# Altium schematic sheet [06] IN_OUT_SENSOR.SchDoc
size A4
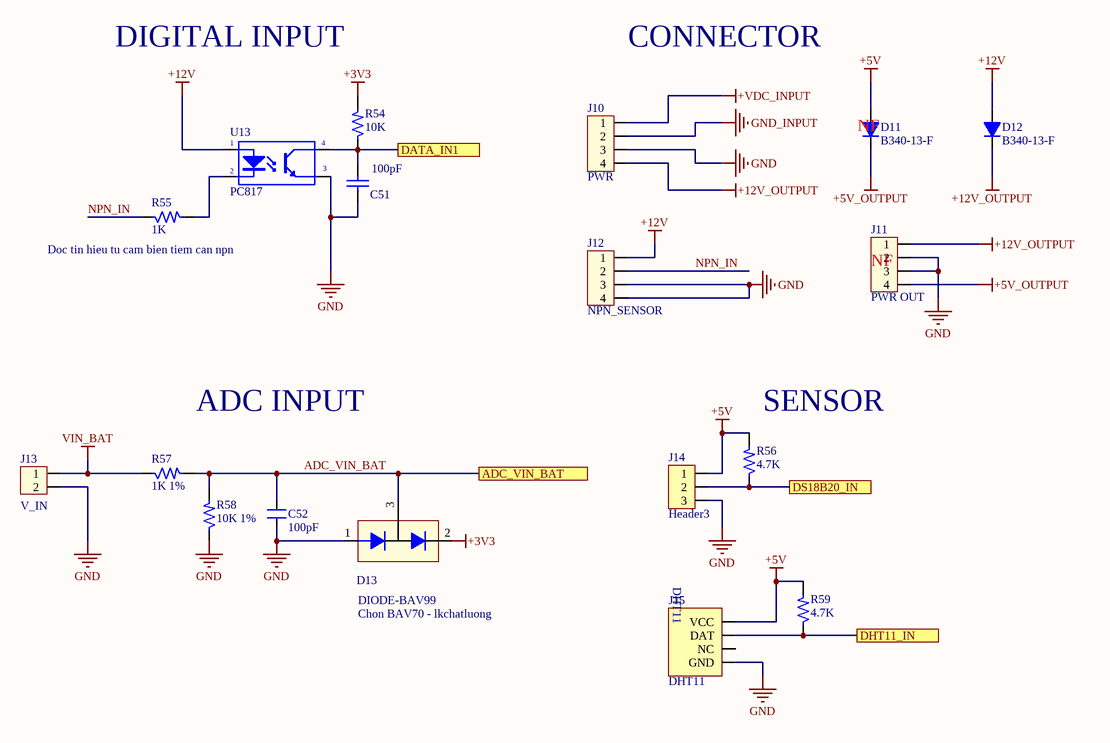
[diagram p0: [06] IN_OUT_SENSOR.SchDoc]

## Parts
C51  100pF  [CAP_0805]
C52  100pF  [CAP_0805]
D11  B340-13-F  [DO-214AB SMA]
D12  B340-13-F  [DO-214AB SMA]
D13  DIODE-BAV99  [SOT23]
J10  PWR  [Hed4V_3.96]
J11  PWR OUT  [CON_2.54mm_4]
J12  NPN_SENSOR  [CON_2.54mm_4]
J13  V_IN  [CON_2.54mm_2]
J14  Header3  [Header3]
J15  DHT11  [DHT11]
R54  10K  [RES-SMD-0805]
R55  1K  [RES-SMD-0805]
R56  4.7K  [RES-SMD-0805]
R57  1K 1%  [RES-SMD-0805]
R58  10K 1%  [RES-SMD-0805]
R59  4.7K  [RES-SMD-0805]
U13  PC817  [DIP4/W0.3]

## Ports
ADC_VIN_BAT, DATA_IN1, DHT11_IN, DS18B20_IN

## Nets
+3V3: D13.2 R54.2
+5V: D11.1(A) J14.1 J15.1(VCC) R56.2 R59.2
+5V_OUTPUT: D11.2(K) J11.4
+12V: D12.1(A) J12.1 U13.1(A)
+12V_OUTPUT: D12.2(K) J10.4 J11.1
+VDC_INPUT: J10.1
GND: C51.2 C52.1 D13.1 J10.3 J11.2 J11.3 J12.3 J12.4 J13.2 J14.3 J15.4(GND) R58.1 U13.3(E)
GND_INPUT: J10.2
VIN_BAT: J13.1 R57.1
ADC_VIN_BAT: C52.2 D13.3 R57.2 R58.2 ; port ADC_VIN_BAT
DATA_IN1: C51.1 R54.1 U13.4(C) ; port DATA_IN1
DHT11_IN: J15.2(DAT) R59.1 ; port DHT11_IN
DS18B20_IN: J14.2 R56.1 ; port DS18B20_IN
NPN_IN: J12.2 R55.1
NetR55_2: R55.2 U13.2(K)

Not connected (* = marked no-connect by the designer): J15 3(NC)

## Notes on the sheet
- DIGITAL INPUT
- CONNECTOR
- (near D11) NF
- (near R55) Doc tin hieu tu cam bien tiem can npn
- (near J11) NF
- ADC INPUT
- (near R56) SENSOR
- Chon BAV70 - lkchatluong

## Library data of the parts
C51 = CapSMD: Capacitor; Value: 33p; Published: 8-Jun-2000; LatestRevisionDate: 17-Jul-2002; LatestRevisionNote: Re-released for DXP Platform.; PackageReference: RAD-0.3; Publisher: Altium Limited
C52 = CM: Cap SMD; Value: 103
D11 D12 = D1A: Diode 1A; Value: 1N4007
D13 = DIODE-BAV99: ZENER, SOT23,; Manufacturer: ON Semiconductor / Fairchild; Manufacturer Part Number: BAV99; .Creator: LeKhaLinh; Other Drawings: Diode Circuit; PCN Design/Specification: Mold Compound 12/Dec/2007; PCN Assembly/Origin: SOT23 Manufacturing Source 31/May2013 / Assembly Site Addition 20/Jul/2015; PCN Packaging: Binary Year Code Marking 15/Jan/2014; Diode Configuration: 1 Pair Series Connection; Diode Type: Standard; Voltage - DC Reverse (Vr) (Max): 70V; Current - Average Rectified (Io) (per Diode): 200mA; Voltage - Forward (Vf) (Max) @ If: 1.25V @ 150mA; Speed: Small Signal =; Reverse Recovery Time (trr): 6ns; Current - Reverse Leakage @ Vr: 2.5µA @ 70V; Online Catalog: Diode Array; Other Names: BAV99FSDKR; .CheckPCB: LeKhaLinh; .CheckSCH: LeKhaLinh; Supplier 1: Digi-Key; Stock 1: 1165; Pricing 1: 1=0.26, 10=0.21, 100=0.1115, 500=0.0734, 1000=0.0499 (USD); Standard Package: 1; Category: Discrete Semiconductor Products; Family: Diodes, Rectifiers - Arrays; Packaging: Digi-Reel®; Mounting Type: Surface Mount; Package / Case: TO-236-3, SC-59, SOT-23-3; Supplier Device Package: SOT-23-3 (TO-236); ComponentLink1URL: https://www.fairchildsemi.com/package-drawings/MA/MA03B.pdf?src-supplier=Digi-Key; ComponentLink1Description: https://www.fairchildsemi.com/package-drawings/MA/MA03B.pdf?src-supplier=Digi-Key; ComponentLink2URL: http://www.farnell.com/datasheets/1822674.pdf?src-supplier=Element14; ComponentLink2Description: http://www.farnell.com/datasheets/1822674.pdf?src-supplier=Element14; ComponentLink3URL: http://www.mouser.com/ds/2/149/BAV99-22788.pdf?src-supplier=Mouser; ComponentLink3Description: http://www.mouser.com/ds/2/149/BAV99-22788.pdf?src-supplier=Mouser; ComponentLink4URL: http://www.fairchildsemi.com/ds/BA/BAV99.pdf?src-supplier=Avnet+Europe; ComponentLink4Description: http://www.fairchildsemi.com/ds/BA/BAV99.pdf?src-supplier=Avnet+Europe; ComponentLink5URL: https://www.verical.com/server-webapp/html/getDatasheet?partID=110217&src-supplier=Verical; ComponentLink5Description: https://www.verical.com/server-webapp/html/getDatasheet?partID=110217&src-supplier=Verical; ComponentLink6URL: http://www.farnell.com/datasheets/2304409.pdf?src-supplier=Element14; ComponentLink6Description: http://www.farnell.com/datasheets/2304409.pdf?src-supplier=Element14; Supplier 2: Mouser; Stock 2: 0; Supplier 3: Arrow; Stock 3: 5700; Pricing 3: 1=0.1933, 10=0.1873, 25=0.1555, 100=0.0806, 250=0.0724, 500=0.0523, 1000=0.0428, 3000=0.0342 (USD); Supplier Part Number 1: BAV99FSCT-ND; Supplier Part Number 2: 512-BAV99; Supplier Part Number 3: BAV99
J10 = Hed4: Header 4 (Green); Value: Header 4
J11 J12 = Con4: Connector 4; Value: Connector 4
J13 = Con2: Connector 2; Value: Connector 2
J14 = Header3: Header IDC, 3 x 1 Pin Vertical 2.54mm Pitch (Non-Boxed, Male); Manufacturer: W¨¹rth Elektronik eiSos GmbH; partNo: 613002143121; ComponentLink1 Description: Manufacturer; ComponentLink2 Description: Datasheet; NoPins: 02; Created Date: 29 March 2013; ComponentLink1URL: http://www.we-online.com; ComponentLink2URL: http://katalog.we-online.de/em/datasheet/6130xx143121.pdf; Created by: Karrer Zheng
J15 = DHT11: Manufacturer: W¨¹rth Elektronik eiSos GmbH; partNo: 613004143121; ComponentLink1 Description: Manufacturer; ComponentLink2 Description: Datasheet; NoPins: 04; Created Date: 29 March 2013; ComponentLink1URL: http://www.we-online.com; ComponentLink2URL: http://katalog.we-online.de/em/datasheet/6130xx143121.pdf; Created by: Karrer Zheng
R54 R56 R58 R59 = RM: Resistor SMD; Value: 1K
R55 R57 = RM: Resistor SMD; Value: 1K
U13 = PC817: Single Opto; Value: PC817